# EAGLE schematic FE3_V3_R11d_corrected (EAGLE 7.7.0)
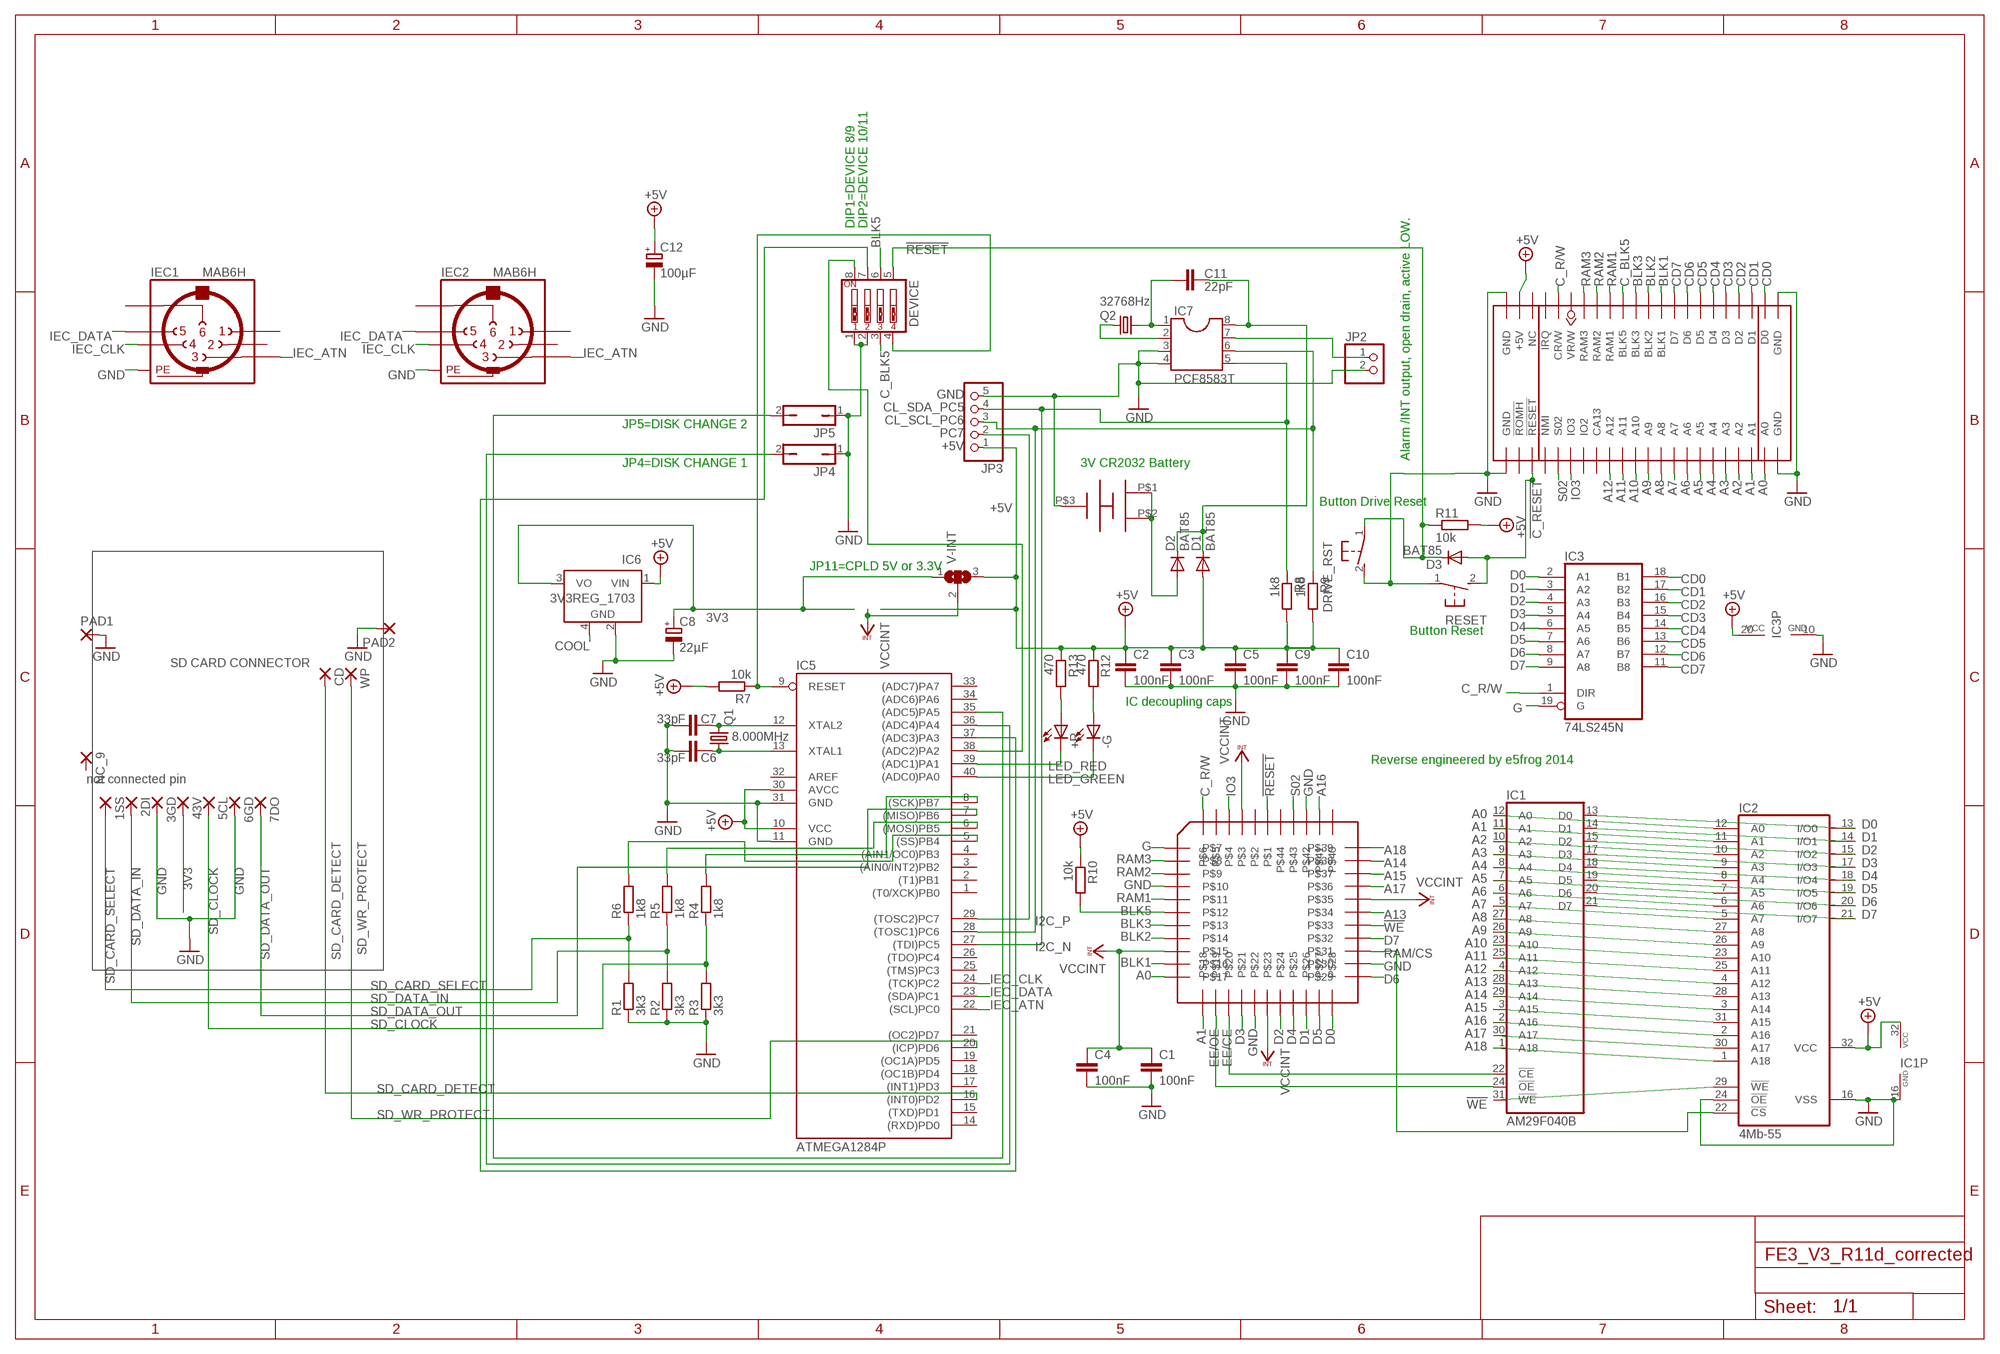
[diagram p0: schematic, sheet 1]

## Parts
1SS  SMD2  [SMD1,27-2,54]
2DI  SMD2  [SMD1,27-2,54]
3GD  SMD2  [SMD1,27-2,54]
5CL  SMD2  [SMD1,27-2,54]
6GD  SMD2  [SMD1,27-2,54]
7DO  SMD2  [SMD1,27-2,54]
43V  SMD2  [SMD1,27-2,54]
+R  LED3MM  [LED3MM]
-G  LED3MM  [LED3MM]
C1  100nF  C-EU050-025X075  [C050-025X075]
C2  100nF  C-EU050-025X075  [C050-025X075]
C3  100nF  C-EU050-025X075  [C050-025X075]
C4  100nF  C-EU050-025X075  [C050-025X075]
C5  100nF  C-EU050-025X075  [C050-025X075]
C6  33pF  C-EUC0805K  [C0805K]
C7  33pF  C-EUC0805K  [C0805K]
C8  22µF  CPOL-EUE2-4  [E2-4]
C9  100nF  C-EU050-025X075  [C050-025X075]
C10  100nF  C-EU050-025X075  [C050-025X075]
C11  22pF  C2.5/2  [C2.5-2]
C12  100µF  CPOL-EUE2-4  [E2-4]
CD  SMD2  [SMD1,27-2,54]
CR2032  CR2032_RETAINER_PK5  [CR2032_RETAINER_PK5]
D1  BAT85  BAT81  [DO34-7]
D2  BAT85  BAT81  [DO34-7]
D3  BAT85  BAT81  [DO34-7]
DEVICE  SW_DIP-4  [EDG-04]
DRIVE_RST  31-XX  [B3F-31XX]
IC1  AM29F040B  AM29F040PAM29F040B  [DIL32]
IC2  4Mb-55  628512P  [DIL32]
IC3  74LS245N  [DIL20]
IC4  CPLD-ATF1504-AS  [S44]
IC5  ATMEGA1284P  MEGA32-P  [DIL40]
IC6  3V3REG_1703  LM2936MP-3.0  [SOT223]
IC7  PCF8583T  PCF8583  [SOT176-1]
IEC1  MAB6H  [MAB6H]
IEC2  MAB6H  [MAB6H]
JP2  PINHD-1X2  [1X02]
JP3  PINHD-1X5  [1X05]
JP4  JP1Q  [JP1]
JP5  JP1Q  [JP1]
NC_9  SMD2  [SMD1,27-2,54]
PAD1  SMD5  [SMD2,54-5,08]
PAD2  SMD5  [SMD2,54-5,08]
Q1  8.000MHz  CRYSTALHC49U-V  [HC49U-V]
Q2  32768Hz  CRYSTALTC26H  [TC26H]
R1  3k3  R-EU_0207/10  [0207/10]
R2  3k3  R-EU_0207/10  [0207/10]
R3  3k3  R-EU_0207/10  [0207/10]
R4  1k8  R-EU_0204/7  [0204/7]
R5  1k8  R-EU_0204/7  [0204/7]
R6  1k8  R-EU_0204/7  [0204/7]
R7  10k  R-EU_0207/10  [0207/10]
R8  1k8  R-EU_0207/10  [0207/10]
R9  1k8  R-EU_0207/10  [0207/10]
R10  10k  R-EU_0207/10  [0207/10]
R11  10k  R-EU_0207/10  [0207/10]
R12  470  R-EU_0207/10  [0207/10]
R13  470  R-EU_0207/10  [0207/10]
RESET  31-XX  [B3F-31XX]
U$2  VIC-20_EXPANSION  [VIC-20_EXPANSION]
V-INT  SJ2W  [SJ_2]
WP  SMD2  [SMD1,27-2,54]

## Nets
3V3: 43V.1(P) C8.+ IC6.3(VO) V-INT.1
!C_RESET: D3.A RESET.2(S) U$2.P$25(!RESET)
!RESET: D3.C DEVICE.5 DRIVE_RST.1(P) IC4.1 R11.1
!WE: IC1.31(!WE) IC2.29(!WE) IC4.33
+5V: C2.1 C3.1 C5.1 C9.1 C10.1 C12.+ D1.A IC1.32(VCC) IC2.32(VCC) IC3.20(VCC) IC5.10(VCC) IC5.30(AVCC) IC6.1(VIN) JP3.1 R7.2 R8.2 R9.2 R10.1 R11.2 R12.1 R13.1 U$2.P$2(+5V) V-INT.3
A0: IC1.12(A0) IC2.12(A0) IC4.17 U$2.P$43(A0)
A1: IC1.11(A1) IC2.11(A1) IC4.18 U$2.P$42(A1)
A2: IC1.10(A2) IC2.10(A2) U$2.P$41(A2)
A3: IC1.9(A3) IC2.9(A3) U$2.P$40(A3)
A4: IC1.8(A4) IC2.8(A4) U$2.P$39(A4)
A5: IC1.7(A5) IC2.7(A5) U$2.P$38(A5)
A6: IC1.6(A6) IC2.6(A6) U$2.P$37(A6)
A7: IC1.5(A7) IC2.5(A7) U$2.P$36(A7)
A8: IC1.27(A8) IC2.27(A8) U$2.P$35(A8)
A9: IC1.26(A9) IC2.26(A9) U$2.P$34(A9)
A10: IC1.23(A10) IC2.23(A10) U$2.P$33(A10)
A11: IC1.25(A11) IC2.25(A11) U$2.P$32(A11)
A12: IC1.4(A12) IC2.4(A12) U$2.P$31(A12)
A13: IC1.28(A13) IC2.28(A13) IC4.34
A14: IC1.29(A14) IC2.3(A14) IC4.38
A15: IC1.3(A15) IC2.31(A15) IC4.37
A16: IC1.2(A16) IC2.2(A16) IC4.41
A17: IC1.30(A17) IC2.30(A17) IC4.36
A18: IC1.1(A18) IC2.1(A18) IC4.39
BLK1: IC4.16 U$2.P$13(BLK1)
BLK2: IC4.14 U$2.P$12(BLK2)
BLK3: IC4.13 U$2.P$11(BLK3)
BLK5: DEVICE.6 IC4.12 R10.2
C_BLK5: DEVICE.3 U$2.P$10(BLK5)
C_R/W: IC3.1(DIR) IC4.6 U$2.P$5(CR/W)
CD0: IC3.18(B1) U$2.P$21(D0)
CD1: IC3.17(B2) U$2.P$20(D1)
CD2: IC3.16(B3) U$2.P$19(D2)
CD3: IC3.15(B4) U$2.P$18(D3)
CD4: IC3.14(B5) U$2.P$17(D4)
CD5: IC3.13(B6) U$2.P$16(D5)
CD6: IC3.12(B7) U$2.P$15(D6)
CD7: IC3.11(B8) U$2.P$14(D7)
COOL: IC6.4(GND)
D0: IC1.13(D0) IC2.13(I/O0) IC3.2(A1) IC4.28
D1: IC1.14(D1) IC2.14(I/O1) IC3.3(A2) IC4.26
D2: IC1.15(D2) IC2.15(I/O2) IC3.4(A3) IC4.24
D3: IC1.17(D3) IC2.17(I/O3) IC3.5(A4) IC4.21
D4: IC1.18(D4) IC2.18(I/O4) IC3.6(A5) IC4.25
D5: IC1.19(D5) IC2.19(I/O5) IC3.7(A6) IC4.27
D6: IC1.20(D6) IC2.20(I/O6) IC3.8(A7) IC4.29
D7: IC1.21(D7) IC2.21(I/O7) IC3.9(A8) IC4.32
EE/CE: IC1.22(!CE) IC4.20
EE/OE: IC1.24(!OE) IC4.19
G: IC3.19(G) IC4.7
GND: 3GD.1(P) 6GD.1(P) C1.2 C2.2 C3.2 C4.2 C5.2 C6.2 C7.2 C8.- C9.2 C10.2 C12.- CR2032.P$3 DEVICE.1 DEVICE.2 DRIVE_RST.2(S) IC1.16(GND) IC2.16(VSS) IC2.24(!OE) IC3.10(GND) IC4.10 IC4.22 IC4.30 IC4.42 IC5.11(GND) IC5.31(GND) IC6.2(GND) IC7.3 IC7.4 IEC1.PE IEC1.PE@(PE) IEC2.PE IEC2.PE@(PE) JP2.2 JP3.5 JP4.1 JP5.1 PAD1.1(P) PAD2.1(P) R1.1 R2.1 R3.1 RESET.1(P) U$2.P$1(GND) U$2.P$22(GND) U$2.P$23(GND) U$2.P$44(GND)
I2C_N [DiffPair]: IC5.27((TDI)PC5) IC7.5 JP3.4 R8.1
I2C_P [DiffPair]: IC5.28((TOSC1)PC6) IC7.6 JP3.3 R9.1
IEC_ATN: IC5.22((SCL)PC0) IEC1.3 IEC2.3
IEC_CLK: IC5.24((TCK)PC2) IEC1.4 IEC2.4
IEC_DATA: IC5.23((SDA)PC1) IEC1.5 IEC2.5
IO3: IC4.4 U$2.P$28(IO3)
LED_GREEN: -G.K(C) IC5.40((ADC0)PA0)
LED_RED: +R.K(C) IC5.39((ADC1)PA1)
N$1: DEVICE.7 IC5.37((ADC3)PA3)
N$2: IC5.36((ADC4)PA4) JP4.2
N$3: IC5.35((ADC5)PA5) JP5.2
N$4: +R.A R13.2
N$5: DEVICE.8 IC5.38((ADC2)PA2)
N$6: IC5.29((TOSC2)PC7) JP3.2
N$7: -G.A R12.2
N$9: IC5.8((SCK)PB7) R4.2
N$10: IC5.6((MOSI)PB5) R5.2
N$11: IC5.5((SS)PB4) R6.2
N$12: DEVICE.4 IC5.9(RESET) R7.1
N$15: CR2032.P$1 CR2032.P$2 D2.A
N$28: C7.1 IC5.12(XTAL2) Q1.2
N$29: C6.1 IC5.13(XTAL1) Q1.1
N$31: C11.1 D1.C D2.C IC7.8
N$32: C11.2 IC7.1 Q2.2
N$33: IC7.2 Q2.1
N$34: IC7.7 JP2.1
RAM1: IC4.11 U$2.P$9(RAM1)
RAM2: IC4.9 U$2.P$8(RAM2)
RAM3: IC4.8 U$2.P$7(RAM3)
RAM/CS: IC2.22(!CS) IC4.31
S02: IC4.43 U$2.P$27(S02)
SD_CARD_DETECT: CD.1(P) IC5.16((INT0)PD2)
SD_CARD_SELECT: 1SS.1(P) R1.2 R6.1
SD_CLOCK: 5CL.1(P) R3.2 R4.1
SD_DATA_IN: 2DI.1(P) R2.2 R5.1
SD_DATA_OUT: 7DO.1(P) IC5.7((MISO)PB6)
SD_WR_PROTECT: IC5.20((ICP)PD6) WP.1(P)
VCCINT: C1.1 C4.1 IC4.3 IC4.15 IC4.23 IC4.35 V-INT.2
Unconnected: IC4.2 IC4.5 IC4.40 IC4.44 IC5.1((T0/XCK)PB0) IC5.2((T1)PB1) IC5.3((AIN0/INT2)PB2) IC5.4((AIN1/OC0)PB3) IC5.14((RXD)PD0) IC5.15((TXD)PD1) IC5.17((INT1)PD3) IC5.18((OC1B)PD4) IC5.19((OC1A)PD5) IC5.21((OC2)PD7) IC5.25((TMS)PC3) IC5.26((TDO)PC4) IC5.32(AREF) IC5.33((ADC7)PA7) IC5.34((ADC6)PA6) IEC1.1 IEC1.2 IEC1.6 IEC2.1 IEC2.2 IEC2.6 NC_9.1(P) U$2.P$4(!IRQ) U$2.P$6(VR/W) U$2.P$24(!ROMH) U$2.P$26(!NMI) U$2.P$29(IO2) U$2.P$30(CA13)

## Notes on the sheet
- DIP1=DEVICE 8/9 | DIP2=DEVICE 10/11
- CL_SDA_PC5
- CL_SCL_PC6
- JP5=DISK CHANGE 2 | PC7
- Alarm /INT output, open drain, active LOW.
- JP4=DISK CHANGE 1 | 3V CR2032 Battery
- Button Drive Reset
- JP11=CPLD 5V or 3.3V
- Button Reset
- SD CARD CONNECTOR
- IC decoupling caps
- Reverse engineered by e5frog 2014
- not connected pin

## Power pins joined to a net without a drawn wire
NC: U$2.P$3(NC)

## Library data of the parts
1SS 2DI 3GD 5CL 6GD 7DO 43V CD NC_9 WP = wirepad:SMD2: SMD PAD
+R -G = led:LED: LED OSRAM: - CHIPLED LG R971, LG N971, LY N971, LG Q971, LY Q971, LO R971, LY R971 LH N974, LH R974 LS Q976, LO Q976, LY Q976 LO Q996 - Hyper CHIPLED LW Q18S LB Q993, LB Q99A, LB R99A - SideLED LS A670, LO A670, LY A670, LG A670, LP A670 LB A673, LV A673, LT A673, LW A673 LH A674 LY A675 LS A676, LA A676, LO A676, LY A676, LW A676 LS A679, LY A679, LG A679 - Hyper Micro SIDELED® LS Y876, LA Y876, LO Y876, LY Y876 LT Y87S - SmartLED LW L88C, LW L88S LB L89C, LB L89S, LG L890 LS L89K, LO L89K, LY L89K LS L896, LA L896, LO L896, LY L896 - TOPLED LS T670, LO T670, LY T670, LG T670, LP T670 LSG T670, LSP T670, LSY T670, LOP T670, LYG T670 LG T671, LOG T671, LSG T671 LB T673, LV T673, LT T673, LW T673 LH T674 LS T676, LA T676, LO T676, LY T676, LB T676, LH T676, LSB T676, LW T676 LB T67C, LV T67C, LT T67C, LS T67K, LO T67K, LY T67K, LW E67C LS E67B, LA E67B, LO E67B, LY E67B, LB E67C, LV E67C, LT E67C LW T67C LS T679, LY T679, LG T679 LS T770, LO T770, LY T770, LG T770, LP T770 LB T773, LV T773, LT T773, LW T773 LH T774 LS E675, LA E675, LY E675, LS T675 LS T776, LA T776, LO T776, LY T776, LB T776 LHGB T686 LT T68C, LB T68C - Hyper Mini TOPLED® LB M676 - Mini TOPLED Santana® LG M470 LS M47K, LO M47K, LY M47K Source: http://www.osram.convergy.de LUXEON: - LUMILED® LXK2-PW12-R00, LXK2-PW12-S00, LXK2-PW14-U00, LXK2-PW14-V00 LXK2-PM12-R00, LXK2-PM12-S00, LXK2-PM14-U00 LXK2-PE12-Q00, LXK2-PE12-R00, LXK2-PE12-S00, LXK2-PE14-T00, LXK2-PE14-U00 LXK2-PB12-K00, LXK2-PB12-L00, LXK2-PB12-M00, LXK2-PB14-N00, LXK2-PB14-P00, LXK2-PB14-Q00 LXK2-PR12-L00, LXK2-PR12-M00, LXK2-PR14-Q00, LXK2-PR14-R00 LXK2-PD12-Q00, LXK2-PD12-R00, LXK2-PD12-S00 LXK2-PH12-R00, LXK2-PH12-S00 LXK2-PL12-P00, LXK2-PL12-Q00, LXK2-PL12-R00 Source: www.luxeon.com KINGBRIGHT: KA-3528ASYC Source: www.kingbright.com
C1-C7 C9 C10 = rcl:C-EU: CAPACITOR, European symbol
C8 C12 = resistor:CPOL-EU: POLARIZED CAPACITOR, European symbol
C11 = capacitor-wima:C: CAPACITOR naming: grid - package width
CR2032 = 000_e5frog:CR2032_RETAINER_PK5
D1-D3 = diode:BAT81: DIODE barrier diode
DEVICE = special:SW_DIP-4: DIP SWITCH
DRIVE_RST RESET = switch-omron:31-XX: OMRON SWITCH; MPN: B3F-3100; OC_FARNELL: 959704; OC_NEWARK: 36M3582
IC1 = am29-memory:AM29F040P: 4-Megabit FLASH MEMORY (512 K x 8 bit) 5 V-only
IC2 = memory-hitachi:628512P
IC3 = 74xx-eu:74*245: Octal BUS TRANSCEIVER, 3-state
IC4 = 000_e5frog:CPLD-ATF1504
IC5 = atmel:MEGA32-P: MICROCONTROLLER 32 Kbytes FLASH 2 Kbytes SRAM 1 Kbytes EEPROM USART 8-channel 10 bit ADC Source: www.atmel.com .. doc2503.pdf; MPN: ATMEGA32-16PU; OC_FARNELL: 1661729; OC_NEWARK: 51P1794
IC6 = national-semiconductor:LM2936MP?*: Ultra-Low Quiescent Current LDO Voltage Regulator Source: Data sheet <http://www.national.com/ds/LM/LM2936.pdf>; MF: NATIONAL SEMICONDUCTOR; MPN: LM2936MP-3.0/NOPB; OC_FARNELL: 1496125; OC_NEWARK: 41K4522
IC7 = 000_e5frog:PCF8583
IEC1 IEC2 = mabp8sn:MAB6H: Female CONNECTOR 6 pins with shield, horizontal (DIN 45322); MF: FARNELL; MPN: MAB 6 H; OC_FARNELL: 809901; OC_NEWARK: 67C7887
JP2 = pinhead:PINHD-1X2: PIN HEADER
JP3 = pinhead:PINHD-1X5: PIN HEADER
JP4 JP5 = jumper:JP1Q: JUMPER
PAD1 PAD2 = wirepad:SMD5: SMD PAD
Q1 = crystal:CRYSTAL: CRYSTAL; OC_FARNELL: 1666969; OC_NEWARK: unknown
Q2 = crystal:CRYSTAL: CRYSTAL; OC_FARNELL: unknown; OC_NEWARK: unknown
R1-R13 = rcl:R-EU_: RESISTOR, European symbol
U$2 = 000_e5frog:VIC-20_EXPANSION
V-INT = jumper:SJ2W: SMD solder JUMPER

## Net classes
1 DiffPair: width 0.254 mm, drill 0.4 mm, clearance 0.6 mm